# Altium project FMC-320U-B2.PrjPcb
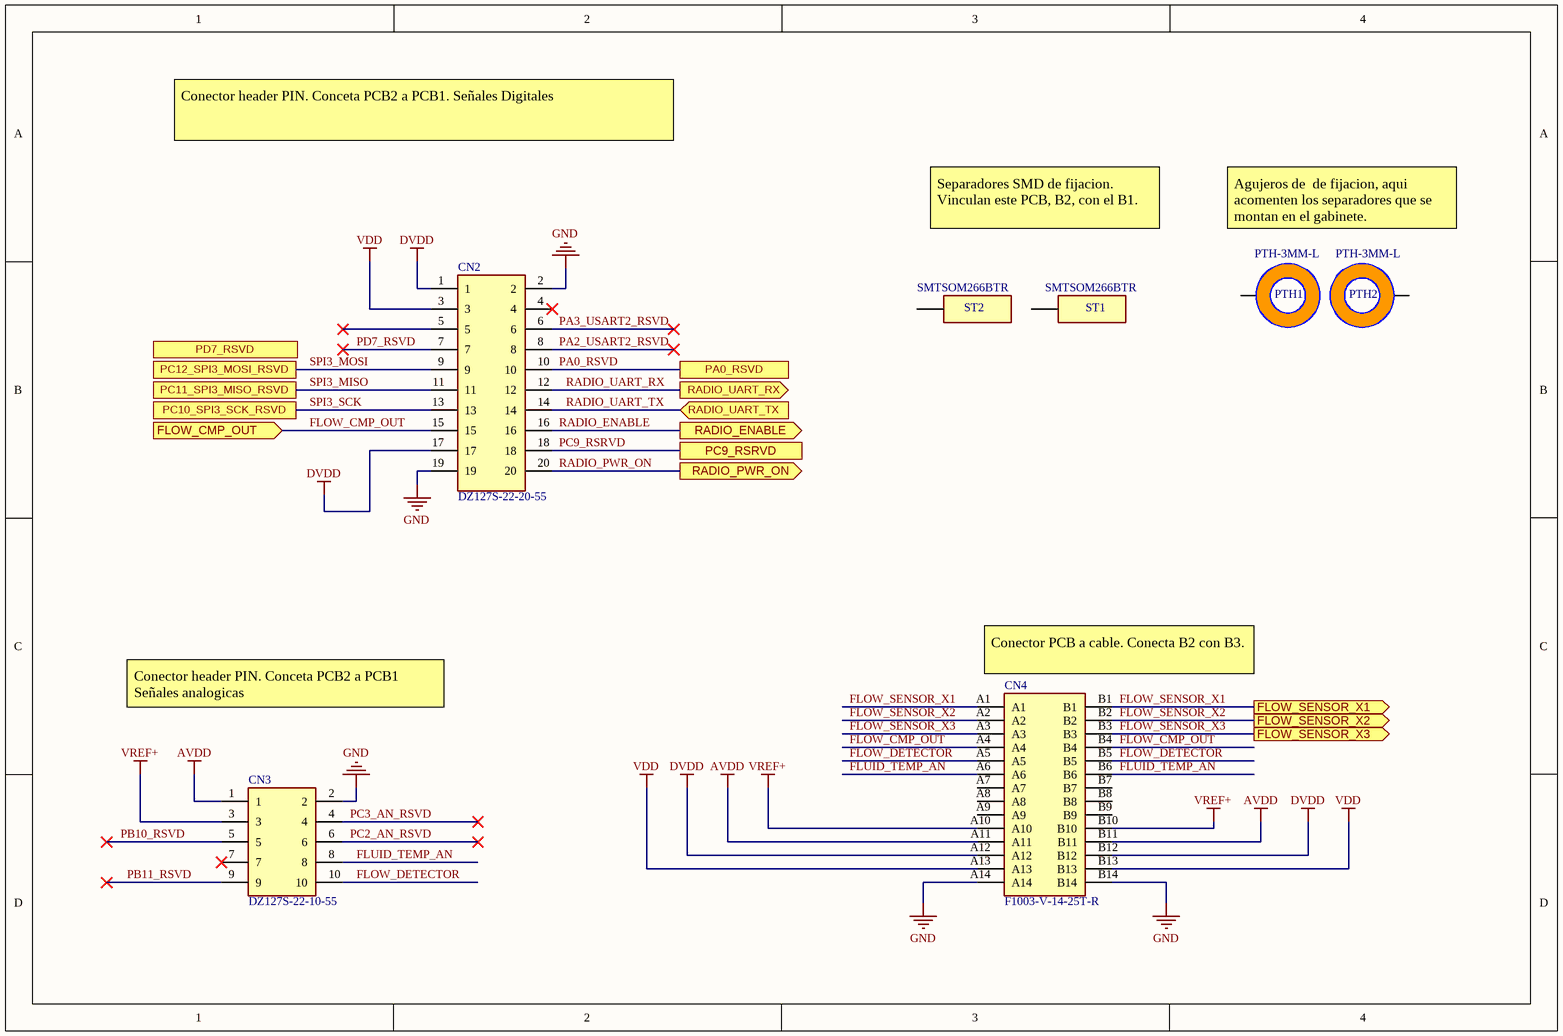
[diagram p0: Interboard.SchDoc]
2 sheets, 12 parts. Net scope: flat (ports and power ports of the same name join across sheets).
Board file: FMC-320U-B2.PcbDoc
Sheets:
  Interboard.SchDoc
  Wireless_Shiled.SchDoc

## Sheet Interboard.SchDoc
size A4; SheetNumber: 1; SheetTotal: 2

### Parts
CN2  DZ127S-22-20-55  [DZ127S-22-20-55]
CN3  DZ127S-22-10-55  [DZ127S-22-10-55]
CN4  F1003-V-14-25T-R  [F1003-V-14-25T-R]
PTH1  PTH-3MM-L  [PTH_M3_L]  (no BOM)
PTH2  PTH-3MM-L  [PTH_M3_L]  (no BOM)
ST1  SMTSOM266BTR  [SMTSOM230BTR]
ST2  SMTSOM266BTR  [SMTSOM230BTR]

### Ports
FLOW_CMP_OUT (in), FLOW_SENSOR_X1 (out), FLOW_SENSOR_X2 (out), FLOW_SENSOR_X3 (out), PA0_RSVD, PC9_RSRVD, PC10_SPI3_SCK_RSVD, PC11_SPI3_MISO_RSVD, PC12_SPI3_MOSI_RSVD, PD7_RSVD, RADIO_ENABLE (out), RADIO_PWR_ON (out), RADIO_UART_RX (out), RADIO_UART_TX (in)

### Nets
AVDD: CN3.1 CN4.A11 CN4.B11
DVDD: CN2.1 CN2.17 CN4.A12 CN4.B12
GND: CN2.2 CN2.19 CN3.2 CN4.A14 CN4.B14
VDD: CN2.3 CN4.A13 CN4.B13
VREF+: CN3.3 CN4.A10 CN4.B10
FLOW_CMP_OUT: CN2.15 CN4.A4 CN4.B4 ; port FLOW_CMP_OUT
FLOW_DETECTOR: CN3.10 CN4.A5 CN4.B5
FLOW_SENSOR_X1: CN4.A1 CN4.B1 ; port FLOW_SENSOR_X1
FLOW_SENSOR_X2: CN4.A2 CN4.B2 ; port FLOW_SENSOR_X2
FLOW_SENSOR_X3: CN4.A3 CN4.B3 ; port FLOW_SENSOR_X3
FLUID_TEMP_AN: CN3.8 CN4.A6 CN4.B6
PA0_RSVD: CN2.10 ; port PA0_RSVD
PA2_USART2_RSVD: CN2.8
PA3_USART2_RSVD: CN2.6
PB10_RSVD: CN3.5
PB11_RSVD: CN3.9
PC2_AN_RSVD: CN3.6
PC3_AN_RSVD: CN3.4
PC9_RSRVD: CN2.18 ; port PC9_RSRVD
PD7_RSVD: CN2.7
RADIO_ENABLE: CN2.16 ; port RADIO_ENABLE
RADIO_PWR_ON: CN2.20 ; port RADIO_PWR_ON
RADIO_UART_RX: CN2.12 ; port RADIO_UART_RX
RADIO_UART_TX: CN2.14 ; port RADIO_UART_TX
SPI3_MISO: CN2.11 ; port PC11_SPI3_MISO_RSVD
SPI3_MOSI: CN2.9 ; port PC12_SPI3_MOSI_RSVD
SPI3_SCK: CN2.13 ; port PC10_SPI3_SCK_RSVD

Not connected (* = marked no-connect by the designer): CN2 4* 5*; CN3 7*; CN4 A7 A8 A9 B7 B8 B9; PTH1 1; PTH2 1; ST1 MH1; ST2 MH1

### Notes on the sheet
- Conector header PIN. Conceta PCB2 a PCB1. Señales Digitales
- Separadores SMD de fijacion. Vinculan este PCB, B2, con el B1.
- Agujeros de  de fijacion, aqui acomenten los separadores que se montan en el gabinete.
- Conector header PIN. Conceta PCB2 a PCB1
  Señales analogicas
- (near CN4) Conector PCB a cable. Conecta B2 con B3.

### Library data of the parts
CN2 = DZ127S-22-20-55: Header Pin SMD 1.27mm 2x10; Manufacturer_Name: SAMTEC; Manufacturer_Part_Number: SFMC-110-02-L-D; Manufacturer: Dealon; Mouser Part Number: 200-SFMC11002LD; Datasheet Link: http://suddendocs.samtec.com/prints/sfmc-1xx-xx-xx-d-xx-mkt.pdf
CN3 = DZ127S-22-10-55: Header PIN SMD 1.27mm 2x5; Manufacturer: Dealon; Manufacturer Part Number: DW127S-22-10-43
CN4 = F1003-V-14-25T-R: 14 Position FFC, FPC Connector Contacts, Vertical - 1 Sided 0.039" (1.00mm) Surface Mount; Manufacturer: XFCN; Vendor Part Number: C2764805; Vendor: LCSC; Manufacturer Part Number: F1003-V-14-25T-R
PTH1 PTH2 = PTH-3MM-L: Montaje M3. algo de holgura y buena corona.; Category: Mounting Hole; Temperature Max: -; Temperature Min: -
ST1 ST2 = SMTSOM266BTR: Standoffs & Spacers SURFACE MOUNT STANDOFF; Manufacturer: Yiyuan; Vendor: LCSC; Price: C49236522; Manufacturer Part Number: SMTSOM266BTR

## Sheet Wireless_Shiled.SchDoc
size A4; SheetNumber: 1; SheetTotal: 2
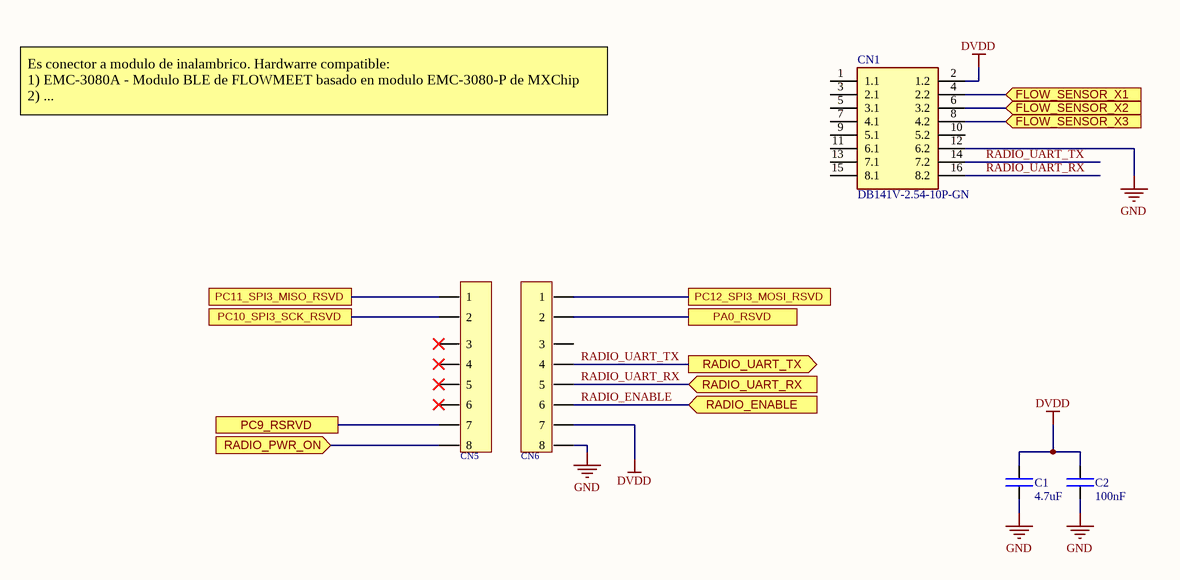
[diagram p1: Wireless_Shiled.SchDoc]

### Parts
C1  4.7uF  [CAP_SM0603_YAGEOCC2_N]
C2  100nF  [CAP_SM0603_YAGEOCC2_N]
CN1  DB141V-2.54-10P-GN  [SHDR16W90P508X254_2X8_2282X1260X1375P]
CN5  DW200R-11-08-43  [DW200R-11-08-43]  (value not drawn)
CN6  DW200R-11-08-43  [DW200R-11-08-43]  (value not drawn)

### Ports
FLOW_SENSOR_X1 (in), FLOW_SENSOR_X2 (in), FLOW_SENSOR_X3 (in), PA0_RSVD, PC9_RSRVD, PC10_SPI3_SCK_RSVD, PC11_SPI3_MISO_RSVD, PC12_SPI3_MOSI_RSVD, RADIO_ENABLE (in), RADIO_PWR_ON (in), RADIO_UART_RX (in), RADIO_UART_TX (out)

### Nets
DVDD: C1.1 C2.1 CN1.2(1.2) CN6.7
GND: C1.2 C2.2 CN1.12(6.2) CN6.8
FLOW_SENSOR_X1: CN1.4(2.2) ; port FLOW_SENSOR_X1
FLOW_SENSOR_X2: CN1.6(3.2) ; port FLOW_SENSOR_X2
FLOW_SENSOR_X3: CN1.8(4.2) ; port FLOW_SENSOR_X3
PA0_RSVD: CN6.2 ; port PA0_RSVD
PC9_RSRVD: CN5.7 ; port PC9_RSRVD
RADIO_ENABLE: CN6.6 ; port RADIO_ENABLE
RADIO_PWR_ON: CN5.8 ; port RADIO_PWR_ON
RADIO_UART_RX: CN1.16(8.2) CN6.5 ; port RADIO_UART_RX
RADIO_UART_TX: CN1.14(7.2) CN6.4 ; port RADIO_UART_TX
SPI3_MISO: CN5.1 ; port PC11_SPI3_MISO_RSVD
SPI3_MOSI: CN6.1 ; port PC12_SPI3_MOSI_RSVD
SPI3_SCK: CN5.2 ; port PC10_SPI3_SCK_RSVD

Not connected (* = marked no-connect by the designer): CN1 1(1.1) 3(2.1) 5(3.1) 7(4.1) 9(5.1) 10(5.2) 11(6.1) 13(7.1) 15(8.1); CN5 3* 4* 5* 6*; CN6 3

### Notes on the sheet
- Es conector a modulo de inalambrico. Hardwarre compatible:
  1) EMC-3080A - Modulo BLE de FLOWMEET basado en modulo EMC-3080-P de MXChip
  2) ...

### Library data of the parts
C1 = CC0603KRX5R6BB475: CAP 4.7uF SM0603 X7R 16V YAGEO; Manufacturer Part Number: CC0603JRX7R7BB473; Tolerance: 10; Category: Capacitor; Manufacturer: Yageo; Package: 0603; Value: 4.7uF; ComponentLink1Description: Manufacturer Website; ComponentLink1URL: http://www.yageo.com
C2 = CC0603KRX7R9BB104: CAP 100nF SM0603 X7R 50V YAGEO CC2; Tolerance (%): 10; Voltage Rating (Volts): 50; Category: Capacitor; Manufacturer: Yageo; Manufacturer Part Number: CC0603KRX7R9BB104; Package: 0603; Value: 100nF; Supplier Part Number 1: 1362556; Supplier 1: Farnell; ComponentLink1URL: http://www.yageo.com; ComponentLink1Description: Manufacturer Website; Supplier 2: Digi-Key; Supplier Part Number 2: 311-1344-1-ND; Datasheet: https://datasheet.lcsc.com/lcsc/2211101700_YAGEO-CC0603KRX7R9BB104_C14663.pdf
CN1 = DB141V-2.54-10P-GN: PCB terminal block, nominal current: 6 A, rated voltage (III/2): 160 V, nominal cross section: 0.5 mm?, Number of potentials: 8, Number of rows: 1, Number of positions per row: 8, product range: FFKDS(A) 0,5/..-V, pitch: 2.54 mm, connection method: Push-in spring connection, mounting: Wave soldering, conductor/PCB connection direction: 90 ?, color: green, Pin layout: Linear double pinning, Solder pin [P]: 3.4 mm, type of packaging: packed in cardboard. The article can be aligned to create different nos. of; Manufacturer: Dorabo; Vendor Part Number: C2898752; Vendor: LCSC; Manufacturer Part Number: DB141V-2.54-10P-GN; Price: 0.82
CN5 CN6 = DW200R-11-08-43: 1 x 8 - tru hole 2mm - altura 4.3mm; Manufacturer: Dealon; Vendor: LCSC; Manufacturer Part Number: DW200R-11-08-43

## Nets that join several sheets
DVDD: Interboard (CN2.1 CN2.17 CN4.A12 CN4.B12), Wireless_Shiled (C1.1 C2.1 CN1.2 CN6.7)
GND: Interboard (5 pins), Wireless_Shiled (C1.2 C2.2 CN1.12 CN6.8)
FLOW_SENSOR_X1: Interboard (CN4.A1 CN4.B1), Wireless_Shiled (CN1.4)
FLOW_SENSOR_X2: Interboard (CN4.A2 CN4.B2), Wireless_Shiled (CN1.6)
FLOW_SENSOR_X3: Interboard (CN4.A3 CN4.B3), Wireless_Shiled (CN1.8)
PA0_RSVD: Interboard (CN2.10), Wireless_Shiled (CN6.2)
PC9_RSRVD: Interboard (CN2.18), Wireless_Shiled (CN5.7)
RADIO_ENABLE: Interboard (CN2.16), Wireless_Shiled (CN6.6)
RADIO_PWR_ON: Interboard (CN2.20), Wireless_Shiled (CN5.8)
RADIO_UART_RX: Interboard (CN2.12), Wireless_Shiled (CN1.16 CN6.5)
RADIO_UART_TX: Interboard (CN2.14), Wireless_Shiled (CN1.14 CN6.4)
SPI3_MISO: Interboard (CN2.11), Wireless_Shiled (CN5.1)
SPI3_MOSI: Interboard (CN2.9), Wireless_Shiled (CN6.1)
SPI3_SCK: Interboard (CN2.13), Wireless_Shiled (CN5.2)